# Altium schematic sheet mech_comp.SchDoc
size A; SheetNumber: 6; SheetTotal: 6
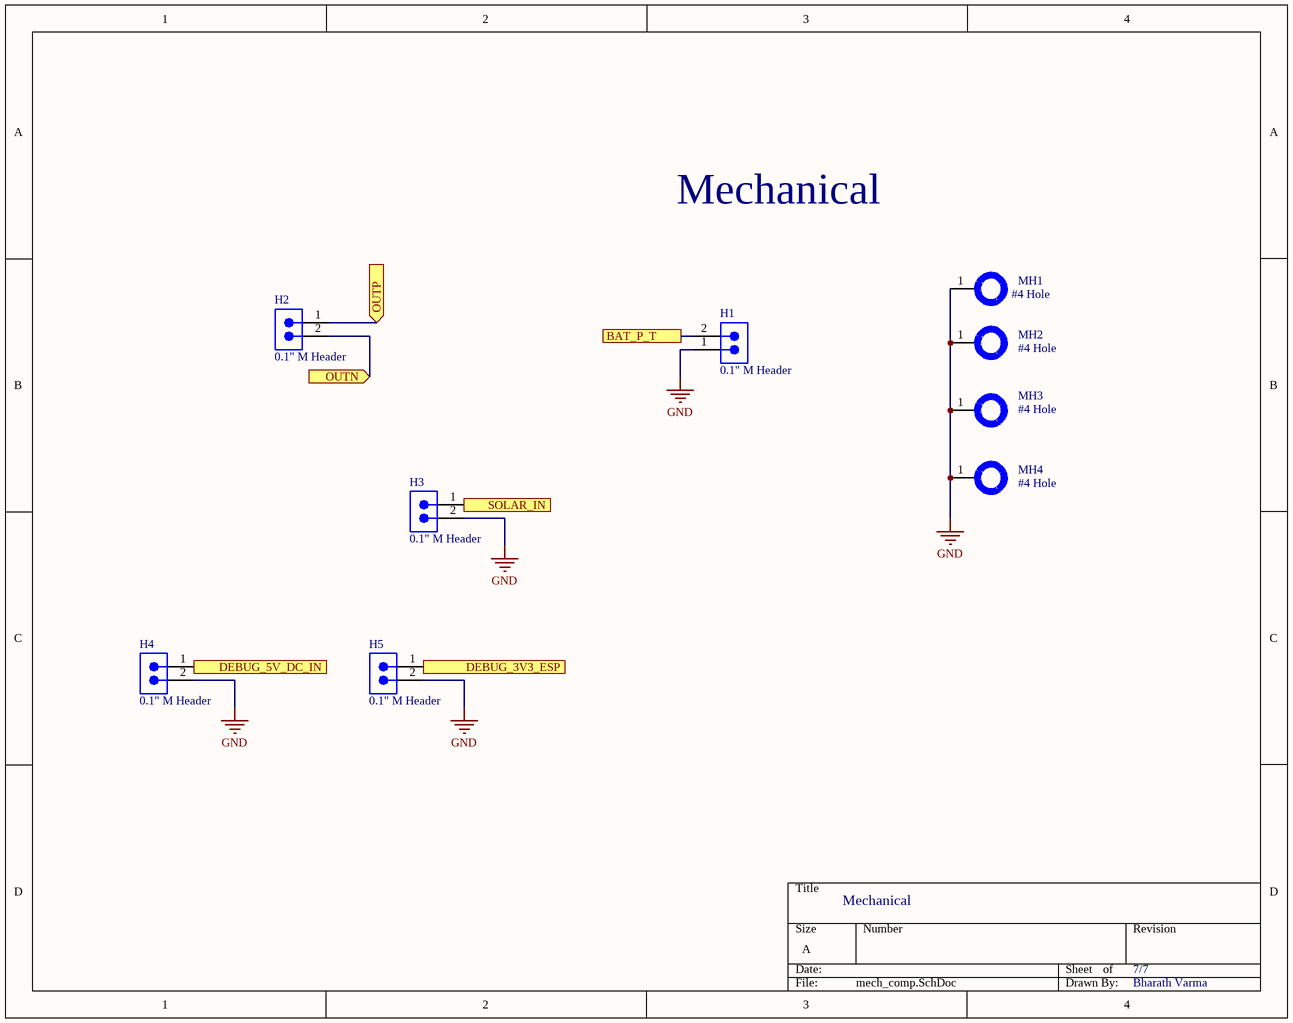
[diagram p0: mech_comp.SchDoc]

## Parts
H1  0.1" M Header  [2-PIN_MALE_HEADER_01-IN]
H2  0.1" M Header  [2-PIN_MALE_HEADER_01-IN]
H3  0.1" M Header  [2-PIN_MALE_HEADER_01-IN]
H4  0.1" M Header  [2-PIN_MALE_HEADER_01-IN]
H5  0.1" M Header  [2-PIN_MALE_HEADER_01-IN]
MH1  #4 Hole  [HOLE_#4]  (no BOM)
MH2  #4 Hole  [HOLE_#4]  (no BOM)
MH3  #4 Hole  [HOLE_#4]  (no BOM)
MH4  #4 Hole  [HOLE_#4]  (no BOM)

## Ports
BAT_P_T (see BQ25798_PMIC[4C]), DEBUG_3V3_ESP (out, see ESP32_SoC[4A]), DEBUG_5V_DC_IN (out, see BQ25798_PMIC[1A]), OUTN (in, see MAX9857A_audio_amp[3B]), OUTP (in, see MAX9857A_audio_amp[3B]), SOLAR_IN (out, see BQ25798_PMIC[1A])

## Nets
GND: H1.1 H3.2 H4.2 H5.2 MH1.1 MH2.1 MH3.1 MH4.1
BAT_P_T: H1.2 ; port BAT_P_T
DEBUG_3V3_ESP: H5.1 ; port DEBUG_3V3_ESP
DEBUG_5V_DC_IN: H4.1 ; port DEBUG_5V_DC_IN
OUTN: H2.2 ; port OUTN
OUTP: H2.1 ; port OUTP
SOLAR_IN: H3.1 ; port SOLAR_IN

## Notes on the sheet
- Mechanical
- 7/7
- Bharath Varma

## Library data of the parts
H1-H5 = PRPC002SAAN-RC: CONN HEADER VERT 2POS 2.54MM; Manufacturer: Sullins; Connector Type: Header, Unshrouded, Breakaway; Number of Positions: 2; Number of Positions Loaded: All; Pitch: 0.100" (2.54mm); Online Catalog: 0.100" (2.54mm) Pitch Connector Headers; Other Names: S9510E-02  S9510E-02-ND; Supplier 1: Digi-Key; Manufacturer Part Number: PRPC002SAAN-RC; Stock 1: 42739; Pricing 1: 1=0.08, 10=0.073, 25=0.054, 50=0.0464, 100=0.0449, 250=0.0387, 500=0.0372 (USD); Standard Package: 1; Category: Connectors, Interconnects; Family: Rectangular Connectors - Headers, Male Pins; Series: -; Packaging: Bulk; Contact Type: Male Pin; Number of Rows: 1; Row Spacing: -; Contact Mating Length: 0.230" (5.84mm); Mounting Type: Through Hole; Termination: Solder; Fastening Type: -; Features: -; Contact Finish: Gold; Contact Finish Thickness: Flash; Color: Black; ComponentLink1URL: https://media.digikey.com/PDF/Data%20Sheets/Sullins%20PDFs/xRxCzzzSxxN-RC_ST_11635-B.pdf?src-supplier=Digi-Key; ComponentLink1Description: https://media.digikey.com/PDF/Data%20Sheets/Sullins%20PDFs/xRxCzzzSxxN-RC_ST_11635-B.pdf?src-supplier=Digi-Key; Supplier Part Number 1: S1011EC-02-ND
MH1-MH4 = HOLE_#4